# Altium schematic sheet THUMB_CONNECTOR.SchDoc
size Letter; SheetNumber: 3; SheetTotal: 15
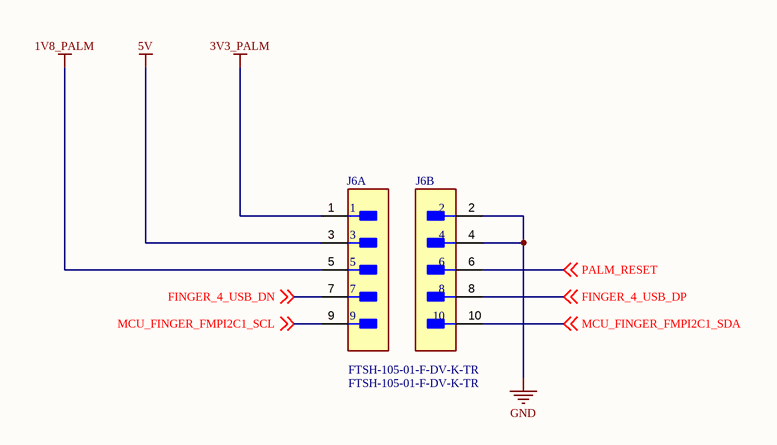
[diagram p0: THUMB_CONNECTOR.SchDoc]

## Parts
J6  FTSH-105-01-F-DV-K-TR  [FP-FTSH-105-01-F-DV-K-TR-MFG]  (parts A,B of 2)

## Nets
1V8_PALM: J6.5
3V3_PALM: J6.1
5V: J6.3
GND: J6.2 J6.4
FINGER_4_USB_DN: J6.7 ; off-sheet FINGER_4_USB_DN
FINGER_4_USB_DP: J6.8 ; off-sheet FINGER_4_USB_DP
MCU_FINGER_FMPI2C1_SCL: J6.9 ; off-sheet MCU_FINGER_FMPI2C1_SCL
MCU_FINGER_FMPI2C1_SDA: J6.10 ; off-sheet MCU_FINGER_FMPI2C1_SDA
PALM_RESET: J6.6 ; off-sheet PALM_RESET

## Notes on the sheet
- Title
- Copyright (c) Meta Platforms, Inc. and affiliates.
  All rights reserved.
  This source code is licensed under the license found in the
  LICENSE file in the root directory of this source tree.
- Sheet
- of

## Library data of the parts
J6 = CMP-02766-000004-2: CONN HEADER SMD 10POS 1.27MM; Number of Contacts: 10; Max Current Rating: 1.75A; Max Operating Temperature: 125°C; Number of Rows: 2; Pitch: 1.27mm; Contact Plating: Gold; Length: 6.35mm; Min Operating Temperature: -55°C; Packaging: Tape and Reel; Orientation: Straight; Contact Material: Bronze; Depth: 3.43mm; Housing Color: Black; Housing Material: Polymer; Radiation Hardening: No; Termination: Solder; Lead Free: Lead Free